# Altium schematic sheet 09-STM32-02.SchDoc
size B; SheetNumber: 9; SheetTotal: 12
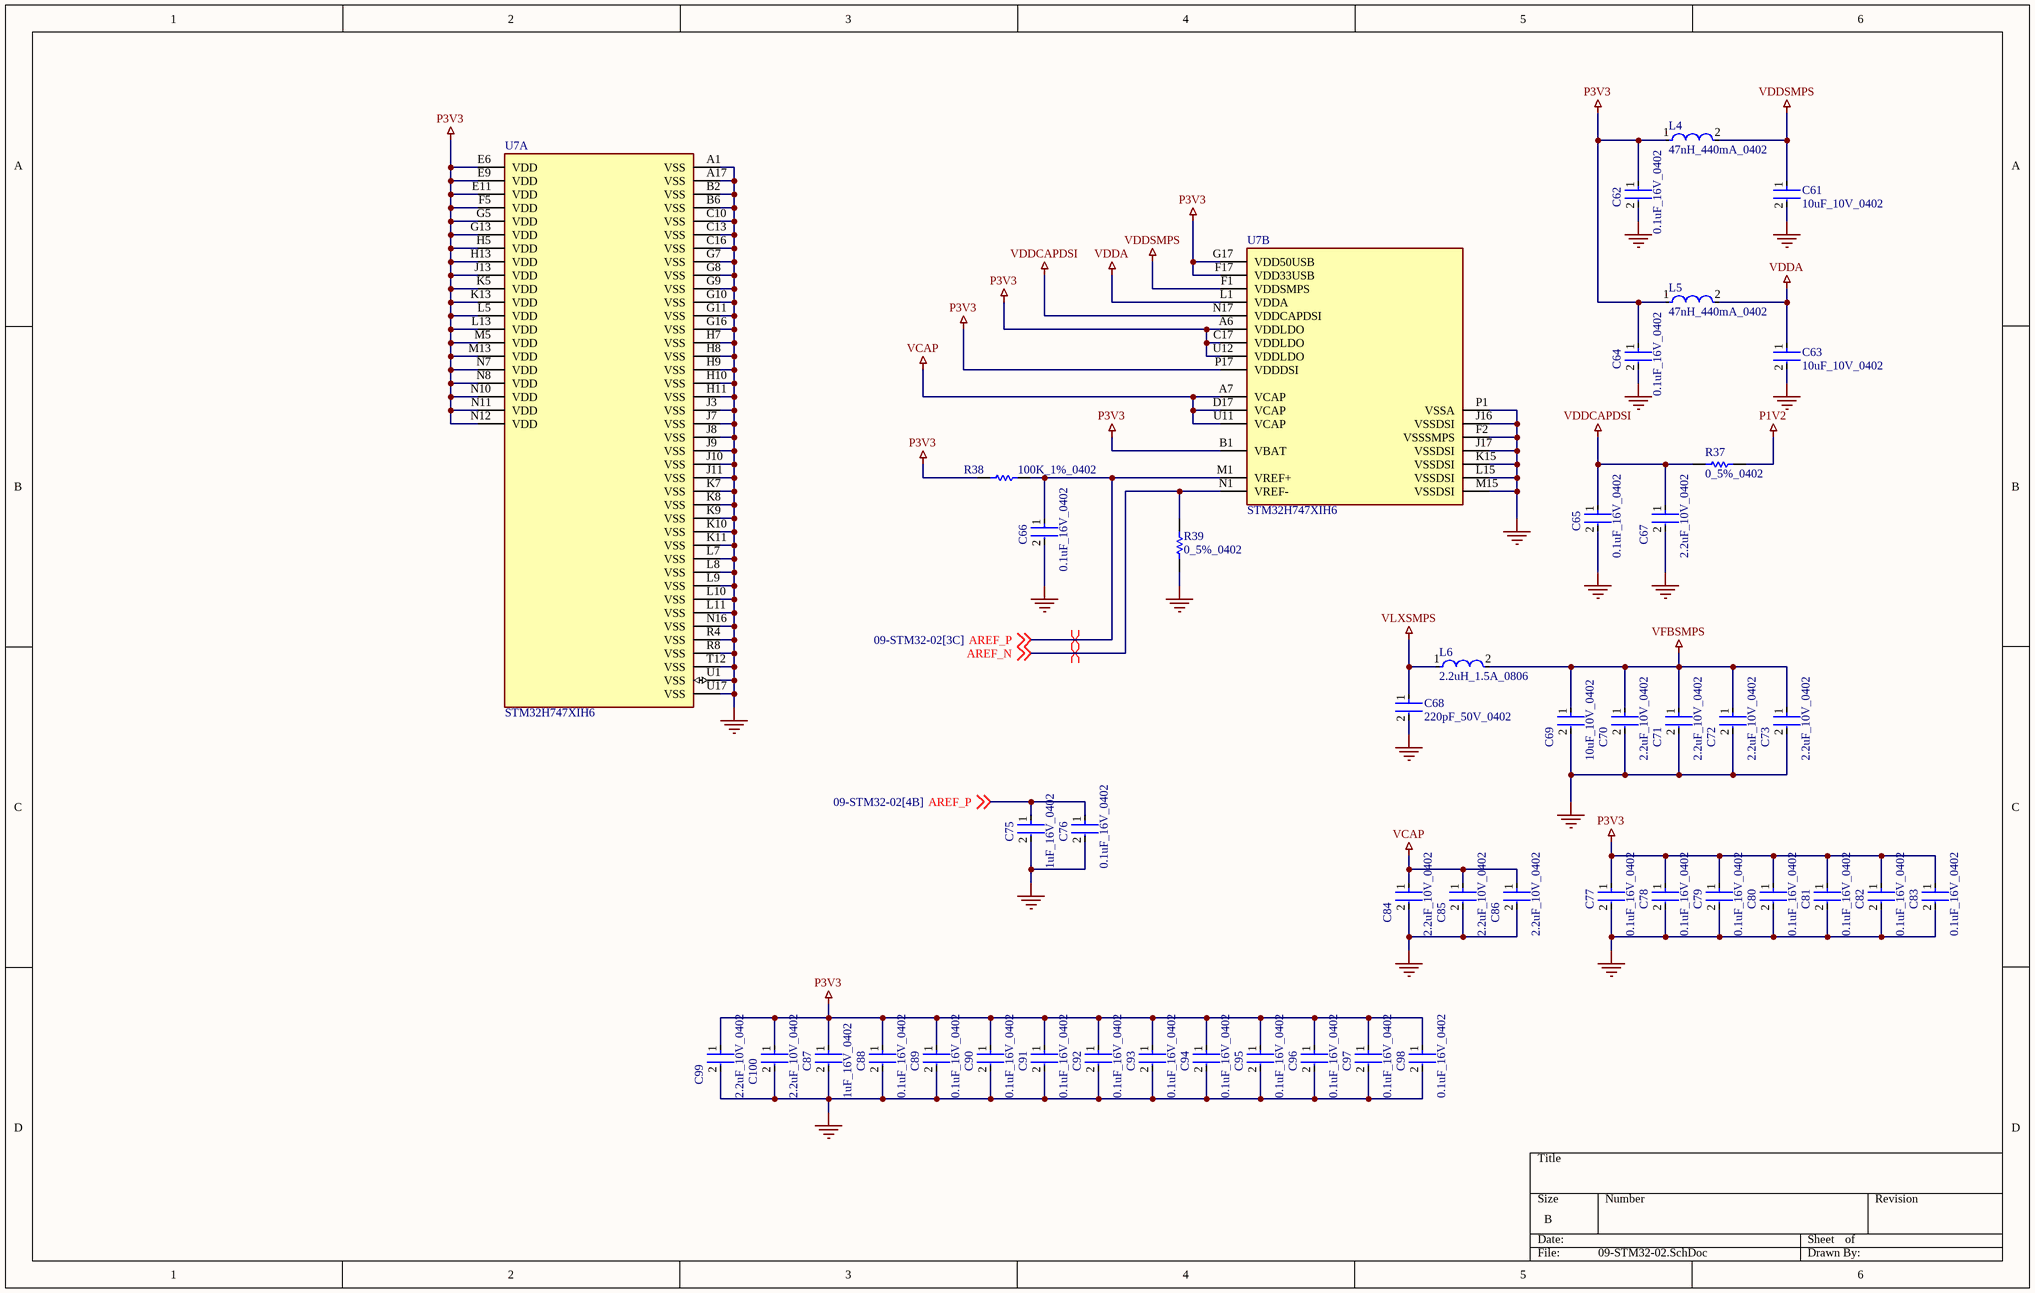
[diagram p0: 09-STM32-02.SchDoc]

## Parts
C61  10uF_10V_0402  [FP-CL05A106MP5NUNC-MFG]
C62  0.1uF_16V_0402  [FP-C0402-BB-MFG]
C63  10uF_10V_0402  [FP-CL05A106MP5NUNC-MFG]
C64  0.1uF_16V_0402  [FP-C0402-BB-MFG]
C65  0.1uF_16V_0402  [FP-C0402-BB-MFG]
C66  0.1uF_16V_0402  [FP-C0402-BB-MFG]
C67  2.2uF_10V_0402  [FP-C1005-050-0_15-0_1-MFG]
C68  220pF_50V_0402  [FP-GCM155-0_05-IPC_C]
C69  10uF_10V_0402  [FP-CL05A106MP5NUNC-MFG]
C70  2.2uF_10V_0402  [FP-C1005-050-0_15-0_1-MFG]
C71  2.2uF_10V_0402  [FP-C1005-050-0_15-0_1-MFG]
C72  2.2uF_10V_0402  [FP-C1005-050-0_15-0_1-MFG]
C73  2.2uF_10V_0402  [FP-C1005-050-0_15-0_1-MFG]
C75  1uF_16V_0402  [FP-0402-L_1_0_0_05-W_0_5-IPC_A]
C76  0.1uF_16V_0402  [FP-C0402-BB-MFG]
C77  0.1uF_16V_0402  [FP-C0402-BB-MFG]
C78  0.1uF_16V_0402  [FP-C0402-BB-MFG]
C79  0.1uF_16V_0402  [FP-C0402-BB-MFG]
C80  0.1uF_16V_0402  [FP-C0402-BB-MFG]
C81  0.1uF_16V_0402  [FP-C0402-BB-MFG]
C82  0.1uF_16V_0402  [FP-C0402-BB-MFG]
C83  0.1uF_16V_0402  [FP-C0402-BB-MFG]
C84  2.2uF_10V_0402  [FP-C1005-050-0_15-0_1-MFG]
C85  2.2uF_10V_0402  [FP-C1005-050-0_15-0_1-MFG]
C86  2.2uF_10V_0402  [FP-C1005-050-0_15-0_1-MFG]
C87  1uF_16V_0402  [FP-0402-L_1_0_0_05-W_0_5-IPC_A]
C88  0.1uF_16V_0402  [FP-C0402-BB-MFG]
C89  0.1uF_16V_0402  [FP-C0402-BB-MFG]
C90  0.1uF_16V_0402  [FP-C0402-BB-MFG]
C91  0.1uF_16V_0402  [FP-C0402-BB-MFG]
C92  0.1uF_16V_0402  [FP-C0402-BB-MFG]
C93  0.1uF_16V_0402  [FP-C0402-BB-MFG]
C94  0.1uF_16V_0402  [FP-C0402-BB-MFG]
C95  0.1uF_16V_0402  [FP-C0402-BB-MFG]
C96  0.1uF_16V_0402  [FP-C0402-BB-MFG]
C97  0.1uF_16V_0402  [FP-C0402-BB-MFG]
C98  0.1uF_16V_0402  [FP-C0402-BB-MFG]
C99  2.2uF_10V_0402  [FP-C1005-050-0_15-0_1-MFG]
C100  2.2uF_10V_0402  [FP-C1005-050-0_15-0_1-MFG]
L4  47nH_440mA_0402  [FP-LQW15AN_80-MFG]
L5  47nH_440mA_0402  [FP-LQW15AN_80-MFG]
L6  2.2uH_1.5A_0806  [FP-DFE201612C-MFG]
R37  0_5%_0402  [RESC1005X40X25NL05T10]
R38  100K_1%_0402  [RESC1005X40X25ML05T10]
R39  0_5%_0402  [RESC1005X40X25NL05T10]
U7  STM32H747XIH6  [FP-TFBGA240+25-A07U-MFG]  (parts A,B of 5)

## Nets
GND: C61.2 C62.2 C63.2 C64.2 C65.2 C66.2 C67.2 C68.2 C69.2 C70.2 C71.2 C72.2 C73.2 C75.2 C76.2 C77.2 C78.2 C79.2 C80.2 C81.2 C82.2 C83.2 C84.2 C85.2 C86.2 C87.2 C88.2 C89.2 C90.2 C91.2 C92.2 C93.2 C94.2 C95.2 C96.2 C97.2 C98.2 C99.2 C100.2 R39.1 U7.A1(VSS) U7.A17(VSS) U7.B2(VSS) U7.B6(VSS) U7.C10(VSS) U7.C13(VSS) U7.C16(VSS) U7.F2(VSSSMPS) U7.G7(VSS) U7.G8(VSS) U7.G9(VSS) U7.G10(VSS) U7.G11(VSS) U7.G16(VSS) U7.H7(VSS) U7.H8(VSS) U7.H9(VSS) U7.H10(VSS) U7.H11(VSS) U7.J3(VSS) U7.J7(VSS) U7.J8(VSS) U7.J9(VSS) U7.J10(VSS) U7.J11(VSS) U7.J16(VSSDSI) U7.J17(VSSDSI) U7.K7(VSS) U7.K8(VSS) U7.K9(VSS) U7.K10(VSS) U7.K11(VSS) U7.K15(VSSDSI) U7.L7(VSS) U7.L8(VSS) U7.L9(VSS) U7.L10(VSS) U7.L11(VSS) U7.L15(VSSDSI) U7.M15(VSSDSI) U7.N16(VSS) U7.P1(VSSA) U7.R4(VSS) U7.R8(VSS) U7.T12(VSS) U7.U1(VSS) U7.U17(VSS)
P1V2: R37.1
P3V3: C62.1 C64.1 C77.1 C78.1 C79.1 C80.1 C81.1 C82.1 C83.1 C87.1 C88.1 C89.1 C90.1 C91.1 C92.1 C93.1 C94.1 C95.1 C96.1 C97.1 C98.1 C99.1 C100.1 L4.1 L5.1 R38.1 U7.A6(VDDLDO) U7.B1(VBAT) U7.C17(VDDLDO) U7.E6(VDD) U7.E9(VDD) U7.E11(VDD) U7.F5(VDD) U7.F17(VDD33USB) U7.G5(VDD) U7.G13(VDD) U7.G17(VDD50USB) U7.H5(VDD) U7.H13(VDD) U7.J13(VDD) U7.K5(VDD) U7.K13(VDD) U7.L5(VDD) U7.L13(VDD) U7.M5(VDD) U7.M13(VDD) U7.N7(VDD) U7.N8(VDD) U7.N10(VDD) U7.N11(VDD) U7.N12(VDD) U7.P17(VDDDSI) U7.U12(VDDLDO)
VCAP: C84.1 C85.1 C86.1 U7.A7(VCAP) U7.D17(VCAP) U7.U11(VCAP)
VDDA: C63.1 L5.2 U7.L1(VDDA)
VDDCAPDSI: C65.1 C67.1 R37.2 U7.N17(VDDCAPDSI)
VDDSMPS: C61.1 L4.2 U7.F1(VDDSMPS)
VFBSMPS: C69.1 C70.1 C71.1 C72.1 C73.1 L6.2
VLXSMPS: C68.1 L6.1
AREF_N: R39.2 U7.N1(VREF-) ; off-sheet AREF_N
AREF_P: C66.1 C75.1 C76.1 R38.2 U7.M1(VREF+) ; off-sheet AREF_P

## Layout directives
differential pair: AREF_N, AREF_P

## Library data of the parts
C61 C63 C69 = CMP-13271-000002-1: CAP CER 10UF 10V X5R 0402; Manufacturer Part Number: CL05A106MP5NUNC; Manufacturer: Samsung; Temperature Coefficient: 15%; Tolerance: 20%; Material: Ceramic; Octopart: https://octopart.com/cl05a106mp5nunc-samsung-22457395; Voltage Rating: 10V; RoHS: TRUE; Value: 10uF; Height: 0.7mm; Digikey Description: CAP CER 10UF 10V X5R 0402; Automotive: No; Package: CL05A106MP5NUNC; Device Class L1: Passive Components; Capacitance: 10uF; Temperature Range High: +85°C; ComponentLink2Description: Datasheet; Device Class L2: Capacitors; Temperature Characteristic: X5R; Temperature: -55°C to +85°C; ComponentLink2URL: http://www.samsungsem.com/kr/support/product-search/mlcc/__icsFiles/afieldfile/2019/05/10/19-CL05A106MP5NUNC.pdf; Device Class L3: Ceramic Capacitors; Category: Cap; Temperature Range Low: -55°C; Ipc Land Pattern Name: CAPC10050X50; Lead Free: Yes
C62 C64-C66 C76-C83 C88-C98 = CMP-1034-02068-3: CAP CER 0.1UF 16V 5% X7R 0402; Manufacturer: Kemet; Manufacturer Part Number: C0402C104J4RACTU; Value: 0.10 μF; Temperature Coefficient: 15%; Tolerance: 0.05; Material: Ceramic; ComponentLink2URL: https://content.kemet.com/datasheets/KEM_C1002_X7R_SMD.pdf; Automotive: No; Device Class L2: Capacitors; Temperature: -55°C to +125°C; RoHS: TRUE; Voltage Rating: 16 V; ComponentLink2Description: Datasheet; Device Class L3: Ceramic Capacitors; Temperature Range Low: -55°C; Ipc Land Pattern Name: CAPC10050X50; Device Class L1: Passive Components; Temperature Range High: +125°C; Package: C0402-BB; Capacitance: 0.10 μF; Category: Cap; Mouser Description: CAP CER 0.1UF 16V X7R 0402; Height: 0.55mm; Digikey Description: CAP CER 0.1UF 16V 5% X7R 0402; Octopart: https://octopart.com/c0402c104j4ractu-kemet-12573893; Temperature Characteristic: X7R; Lead Free: Yes
C67 C70-C73 C84-C86 C99 C100 = CMP-08246-004344-1: CAP CER 2.2UF 10V X7S 0402; Dielectric Material: Ceramic; Tolerance: 10%; Mount: Surface Mount; Height: 0.5mm; Package Quantity: 1; Depth: 0.5mm; RoHS Compliant: Yes; Length: 1mm; Thickness: 0.022inch; Packaging: Tape and Reel; Capacitance: 2.2uF; Case Code (Imperial): 0402; Resistor Type: Ceramic; Dielectric: X7S; Case/Package: 0402; Min Operating Temperature: -55°C; Voltage Rating: 10V; Series: C; Weight: 2.3E-05oz; Width: 0.02inch; Voltage Rating (DC): 10V; Case Code (Metric): 1005; Max Operating Temperature: 125°C; Termination: SMD/SMT; Lead Free: Lead Free
C68 = CMP-2008-03726-2: Ceramic Capacitor for Automotive 220pF ±10% 50VDC X7R 0402 Paper T/R; Voltage Rating (DC): 50V; Width: 0.02inch; Depth: 0.5mm; Package Quantity: 1; Min Operating Temperature: -55°C; Max Operating Temperature: 125°C; Mount: Surface Mount; Length: 1mm; Case/Package: 0402; Case Code (Metric): 1005; Ratings: AEC-Q200; Tolerance: 10%; Radiation Hardening: No; Termination: SMD/SMT; Voltage: 50V; Dielectric: X7R; Voltage Rating: 50V; Case Code (Imperial): 0402; Capacitance: 220pF; Packaging: Tape and Reel; Thickness: 0.022inch; Height: 0.5mm
C75 C87 = CMP-14477-000104-2: None; Tolerance: 10%; Voltage Rating: 16V; Dielectric: X5R; Capacitance: 1uF; Packaging: Tape and Reel; Depth: 0.5mm; Mount: Surface Mount; Thickness: 0.022inch; Package Quantity: 1; Min Operating Temperature: -55°C; Series: M; Voltage Rating (DC): 16V; Termination: SMD/SMT; Case/Package: 0402; Number of Pins: 2; Case Code (Imperial): 0402; Length: 1mm; Halogen Free: Halogen Free; Case Code (Metric): 1005; Width: 0.02inch; RoHS Compliant: Yes; Radiation Hardening: No; Max Operating Temperature: 85°C; Height: 0.5mm; Construction: Flat
L4 L5 = CMP-06042-005115-1: Wire Wound RF Inductor 47nH ±5% 440mA 0.648Ω 0402 (1005); Shielding: Unshielded; Core Material: Non-Magnetic; Test Frequency: 100MHz; Q Factor: 25; DC Resistance (DCR): 648mR; Self Resonant Frequency: 3.2GHz; Width: 0.024inch; Packaging: Tape and Reel; Mount: Surface Mount; Resistor Type: Wirewound; Termination: SMD/SMT; Tolerance: 5%; Case Code (Metric): 1005; Min Operating Temperature: -55°C; Current Rating: 440mA; Height: 0.5mm; Max Operating Temperature: 125°C; Case/Package: 0402; Height - Seated (Max): 0.024inch; Length: 0.039inch; Inductance: 47nH; Case Code (Imperial): 0402; Max DC Current: 440mA; Package Quantity: 1
L6 = CMP-06042-007475-1: Shielded Wirewound Inductor 2.2uH 20% 1500mA 0.144Ω 0806 (2016); Core Material: Ferrite; Test Frequency: 1MHz; Current Rating: 2.1A; DC Resistance (DCR): 144mR; Max DC Current: 1.5A; Tolerance: 20%; Length: 0.079inch; Packaging: Tape and Reel; Max Operating Temperature: 125°C; Min Operating Temperature: -40°C; Case/Package: 0806; Case Code (Imperial): 0806; Inductance: 2.2uH; Mount: Surface Mount; Width: 0.063inch; Resistor Type: Wirewound; Case Code (Metric): 2016; Shielding: Shielded; Depth: 1.6mm; Height - Seated (Max): 0.039inch
R37 R39 = CMP-2002-06457-1: Manufacturer: Panasonic; Part Number: ERJ-U020R00X
R38 = CMP-2002-07852-1: Manufacturer: Yageo; Part Number: RC0402FR-13100KL
U7 = CMP-12105-000055-1: HIGH-PERFORMANCE AND DSP WITH DP; Manufacturer: STMicroelectronics; Number Of Uart Channels: 9; Number Of Pwm Channels: 2; Memory Size: 2MBytes; Number Of Ethernet Channels: 1; Ram Size: 1MBytes; Number Of Timers/Counters: 22; Data Bus Width: 32bits; Core Architecture: ARM Cortex-M4, ARM Cortex-M7; Interface: I2C,SPI,UART,USART,CAN,USB,LIN,IrDA,Ethernet,I2S,SMBus,Other; Number Of Adc Channels: 36; Min Supply Voltage: 1.2V; Number Of A/D Converters: 3; Number Of Spi Channels: 6; Max Supply Voltage: 3.6V; Frequency: 480MHz; Memory Type: FLASH; Number Of I2C Channels: 4; Max Junction Temp: +125°C; Standoff Height: 0.15mm; Number Of I/Os: 168; Device Class L2: Embedded Processors and Controllers; Digikey Description: HIGH-PERFORMANCE AND DSP WITH DP; RoHS: TRUE; Lead Free: Yes; Manufacturer Part Number: STM32H747XIH6; ComponentLink2URL: https://www.st.com/resource/en/datasheet/stm32h747xi.pdf; Mouser Description: STM32 Series 2 MB Flash 1 MB RAM 480 MHz 32-Bit Microcontroller - TFBGA-265; Device Class L1: Integrated Circuits (ICs); Ipc Land Pattern Name: BGA289N80P17X17_1400X1400X110; Category: IC; Device Class L3: Microcontrollers; Ambient Temperature Range High: +85°C; Number Of Cores: 2; Temperature Range High: +125°C; ComponentLink2Description: Datasheet; Automotive: No; Ambient Temperature Range Low: -40°C; Package: TFBGA240+25-A07U; Temperature: -40°C to +125°C; Number Of Usb Channels: 2; Temperature Range Low: -40°C; Height: 1.1mm; Octopart: https://octopart.com/stm32h747xih6-stmicroelectronics-100293943